# EAGLE design WeatherStation (EAGLE 7.5.0)
COMPANY: Unparallel; DRAWN: KTOWN; REV: B

## Sheet 1 of 2
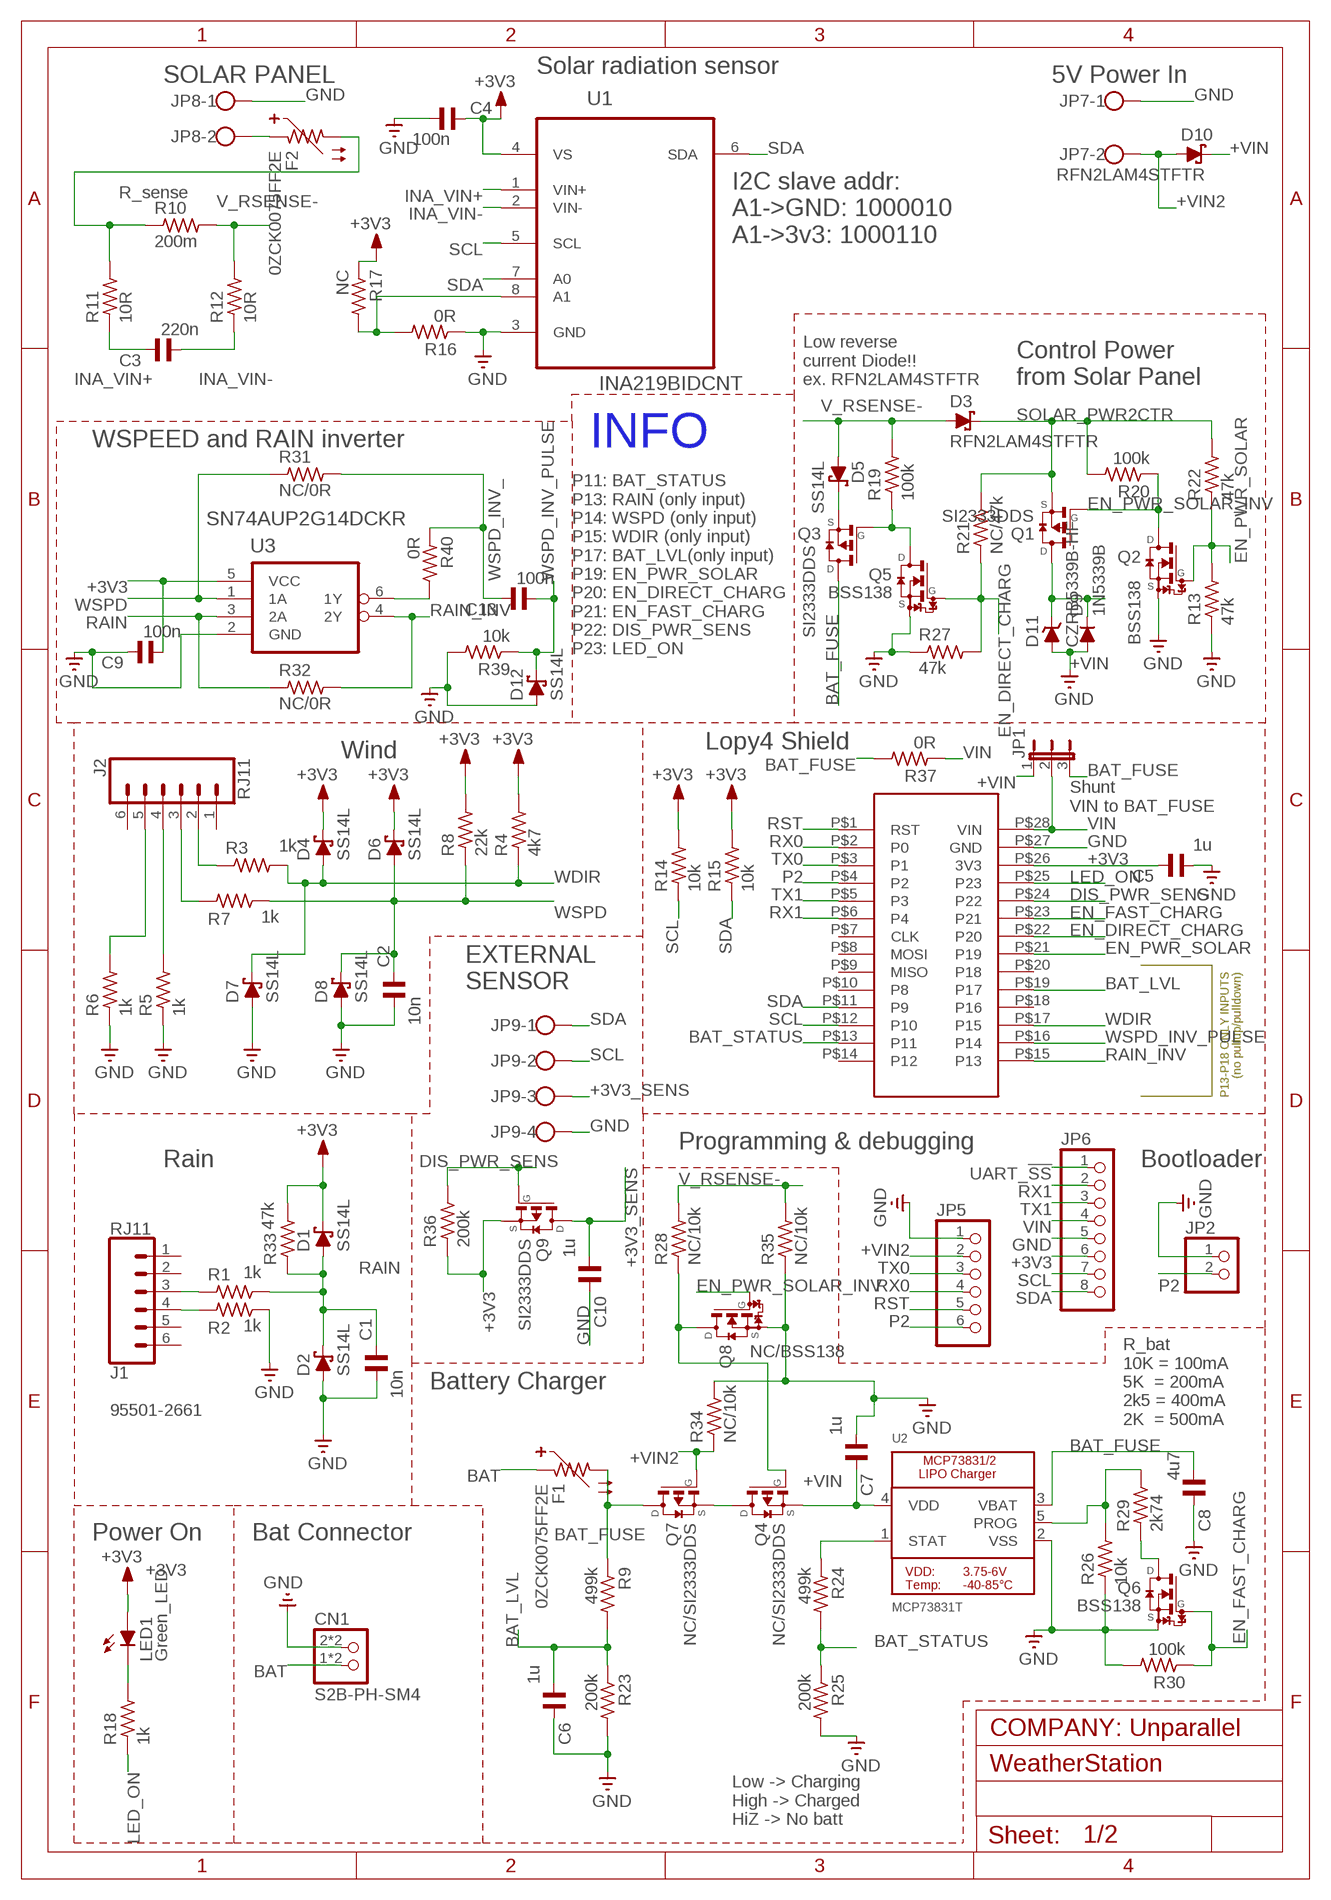
[diagram p0: schematic, sheet 1]

### Parts
C1  10n  C-EUC0603/C0805_PROTO_SLIM  [C0603/C0805_PROTO_SLIM]
C2  10n  C-EUC0603/C0805_PROTO_SLIM  [C0603/C0805_PROTO_SLIM]
C3  220n  C-EUC0603  [C0603]
C4  100n  C-EUC0603  [C0603]
C5  1u  C-EUC0603/C0805_PROTO_SLIM  [C0603/C0805_PROTO_SLIM]
C6  1u  C-EUC0603/C0805_PROTO_SLIM  [C0603/C0805_PROTO_SLIM]
C7  1u  C-EUC0603/C0805_PROTO_SLIM  [C0603/C0805_PROTO_SLIM]
C8  4u7  C-EUC0603/C0805_PROTO_SLIM  [C0603/C0805_PROTO_SLIM]
C9  100n  C-EUC0603  [C0603]
C10  1u  C-EUC0603/C0805_PROTO_SLIM  [C0603/C0805_PROTO_SLIM]
C13  100n  C-EUC0603  [C0603]
CN1  S2B-PH-SM4  JST_2PINHOR_VER  [JST-PH-2-SMT-RA_OK]
D1  SS14L  SCHOTTKY-DIODESUB_SMA_PROTO  [SUB_SMA_PROTO]
D2  SS14L  SCHOTTKY-DIODESUB_SMA_PROTO  [SUB_SMA_PROTO]
D3  RFN2LAM4STFTR  SCHOTTKY-DIODESMA_SOD-128_PROTO  [SMA_SOD-128_PROTO]
D4  SS14L  SCHOTTKY-DIODESUB_SMA_PROTO  [SUB_SMA_PROTO]
D5  SS14L  SCHOTTKY-DIODESUB_SMA_PROTO  [SUB_SMA_PROTO]
D6  SS14L  SCHOTTKY-DIODESUB_SMA_PROTO  [SUB_SMA_PROTO]
D7  SS14L  SCHOTTKY-DIODESUB_SMA_PROTO  [SUB_SMA_PROTO]
D8  SS14L  SCHOTTKY-DIODESUB_SMA_PROTO  [SUB_SMA_PROTO]
D9  1N5339B  DIODE-DO15-12  [DO15-12]
D10  RFN2LAM4STFTR  SCHOTTKY-DIODESMA_SOD-128_PROTO  [SMA_SOD-128_PROTO]
D11  CZRB5339B-HF  ZENER-DIODE-PROTO  [SMB_PROTO]
D12  SS14L  SCHOTTKY-DIODESUB_SMA_PROTO  [SUB_SMA_PROTO]
F1  0ZCK0075FF2E  PTC-0603_0805_PROTO_SLIM  [R0603/R0805_PROTO_SLIM]
F2  0ZCK0075FF2E  PTC-0603_0805_PROTO_SLIM  [R0603/R0805_PROTO_SLIM]
J1  RJ11  RJ11-6  [RJ11-6]
J2  RJ11  RJ11-6  [RJ11-6]
JP1  JP2E-0805  [R0805/2]
JP2  PINHD-1X2  [1X02]
JP5  PINHD-1X6  [1X06]
JP6  PINHD-1X8  [1X08]
JP7  W237-102  [W237-102]
JP8  W237-102  [W237-102]
JP9  W237-4  [W237-4]
LED1  Green_LED  LEDCHIP-LED0805  [CHIP-LED0805]
Q1  SI2333DDS  SI2333DDSPROTO_SLIM  [SOT23_PROTO_SLIM]
Q2  BSS138  NX7002AKPROTO_SLIM  [SOT23_PROTO_SLIM]
Q3  SI2333DDS  SI2333DDSPROTO_SLIM  [SOT23_PROTO_SLIM]
Q4  NC/SI2333DDS  SI2333DDSPROTO_SLIM  [SOT23_PROTO_SLIM]
Q5  BSS138  NX7002AKPROTO_SLIM  [SOT23_PROTO_SLIM]
Q6  BSS138  NX7002AKPROTO_SLIM  [SOT23_PROTO_SLIM]
Q7  NC/SI2333DDS  SI2333DDSPROTO_SLIM  [SOT23_PROTO_SLIM]
Q8  NC/BSS138  NX7002AKPROTO_SLIM  [SOT23_PROTO_SLIM]
Q9  SI2333DDS  SI2333DDSPROTO_SLIM  [SOT23_PROTO_SLIM]
R1  1k  R-EU_R0603  [R0603]
R2  1k  R-EU_R0603  [R0603]
R3  1k  R-EU_R0603  [R0603]
R4  4k7  R-EU_R0603  [R0603]
R5  1k  R-EU_R0603  [R0603]
R6  1k  R-EU_R0603  [R0603]
R7  1k  R-EU_R0603  [R0603]
R8  22k  R-EU_R0603  [R0603]
R9  499k  R-EU_R0603/R0805_PROTO_SLIM  [R0603/R0805_PROTO_SLIM]
R10  200m  R-EU_R0603/R0805_PROTO_SLIM  [R0603/R0805_PROTO_SLIM]
R11  10R  R-EU_R0603  [R0603]
R12  10R  R-EU_R0603  [R0603]
R13  47k  R-EU_R0603  [R0603]
R14  10k  R-EU_R0603  [R0603]
R15  10k  R-EU_R0603  [R0603]
R16  0R  R-EU_R0603  [R0603]
R17  NC  R-EU_R0603  [R0603]
R18  1k  R-EU_R0603  [R0603]
R19  100k  R-EU_R0603  [R0603]
R20  100k  R-EU_R0603  [R0603]
R21  NC/47k  R-EU_R0603  [R0603]
R22  47k  R-EU_R0603  [R0603]
R23  200k  R-EU_R0603/R0805_PROTO_SLIM  [R0603/R0805_PROTO_SLIM]
R24  499k  R-EU_R0603/R0805_PROTO_SLIM  [R0603/R0805_PROTO_SLIM]
R25  200k  R-EU_R0603/R0805_PROTO_SLIM  [R0603/R0805_PROTO_SLIM]
R26  10k  R-EU_R0603  [R0603]
R27  47k  R-EU_R0603  [R0603]
R28  NC/10k  R-EU_R0603  [R0603]
R29  2k74  R-EU_R0603/R0805_PROTO_SLIM  [R0603/R0805_PROTO_SLIM]
R30  100k  R-EU_R0603  [R0603]
R31  NC/0R  R-EU_R0603  [R0603]
R32  NC/0R  R-EU_R0603  [R0603]
R33  47k  R-EU_R0603  [R0603]
R34  NC/10k  R-EU_R0603  [R0603]
R35  NC/10k  R-EU_R0603  [R0603]
R36  200k  R-EU_R0603/R0805_PROTO_SLIM  [R0603/R0805_PROTO_SLIM]
R37  0R  R-EU_R0603  [R0603]
R39  10k  R-EU_R0603  [R0603]
R40  0R  R-EU_R0603  [R0603]
U1  INA219BIDCNT  [SOT65P280X145-8N]
U2  MCP73831T  MCP73831/2  [SOT23-5]
U3  SN74AUP2G14DCKR  SN74AUP2G14-DCKR  [SOT65P210X110-6N_EDIT]
U$2  LOPY4_SHIELD  [LOPY4_SHIELD]

### Nets
+3V3: C4.1 C5.1 C9.2 D1.C D4.C D6.C JP6.6 LED1.A Q9.2(S) R4.2 R8.2 R14.2 R15.2 R17.1 R33.2 R36.1 U1.4(VS) U3.5(VCC) U$2.P$26(3V3) ; also sheet 2
+3V3_SENS: C10.2 JP9.3 Q9.3(D)
+VIN: C7.1 D9.C D10.C D11.C JP1.1 Q1.3(D) Q4.2(S) U2.4(VDD)
+VIN2: D10.A JP5.2 JP7.2 Q7.1(G) R34.1
BAT: CN1.1 CN1.3 F1.1
BAT_FUSE: C8.2 F1.2 JP1.3 Q3.3(D) Q7.3(D) R9.1 R37.2 U2.3(VBAT)
BAT_LVL: C6.2 R9.2 R23.1 U$2.P$19(P17)
BAT_STATUS: R24.2 R25.1 U$2.P$13(P11)
DIS_PWR_SENS: Q9.1(G) R36.2 U$2.P$24(P22)
EN_DIRECT_CHARG: Q5.1(G) R21.1 R27.2 U$2.P$22(P20)
EN_FAST_CHARG: Q6.1(G) R30.1 U$2.P$23(P21)
EN_PWR_SOLAR: Q2.1(G) R13.2 R22.1 U$2.P$21(P19)
EN_PWR_SOLAR_INV: Q1.1(G) Q2.3(D) Q8.1(G) R20.1
GND: C1.2 C2.2 C4.2 C5.2 C6.1 C7.2 C8.1 C9.1 C10.1 CN1.2 CN1.4 D2.A D7.A D8.A D9.A D11.A D12.A JP2.1 JP5.1 JP6.5 JP7.1 JP8.1 JP9.4 Q2.2(S) Q5.2(S) Q6.2(S) Q8.2(S) R2.2 R5.1 R6.1 R13.1 R16.1 R23.2 R25.2 R26.1 R27.1 R30.2 R34.2 R35.1 R39.2 U1.3(GND) U2.2(VSS) U3.2(GND) U$2.P$27(GND) ; also sheet 2
INA_VIN+: C3.1 R11.1 U1.1(VIN+)
INA_VIN-: C3.2 R12.1 U1.2(VIN-)
LED_ON: R18.1 U$2.P$25(P23)
N$1: D5.C Q3.2(S)
N$2: F2.1 JP8.2
N$3: J1.4 R2.1
N$4: J1.3 R1.1
N$5: J2.2 R3.1
N$6: J2.3 R7.1
N$7: J2.4 R5.2
N$8: J2.5 R6.2
N$9: Q4.1(G) Q8.3(D) R28.1
N$10: R26.2 R29.2 U2.5(PROG)
N$11: R16.2 R17.2 U1.8(A1)
N$12: LED1.C R18.2
N$13: Q6.3(D) R29.1
N$14: R40.2 U3.6(1Y)
N$15: Q3.1(G) Q5.3(D) R19.1
N$19: R24.1 U2.1(STAT)
N$21: Q4.3(D) Q7.2(S)
P2: JP2.2 JP5.6 U$2.P$4(P2)
RAIN: C1.1 D1.A D2.C R1.2 R32.1 R33.1 U3.3(2A)
RAIN_INV: R32.2 U3.4(2Y) U$2.P$15(P13) ; also sheet 2
RST: JP5.5 U$2.P$1(RST) ; also sheet 2
RX0: JP5.4 U$2.P$2(P0)
RX1: JP6.2 U$2.P$6(P4) ; also sheet 2
SCL: JP6.7 JP9.2 R14.1 U1.5(SCL) U$2.P$12(P10) ; also sheet 2
SDA: JP6.8 JP9.1 R15.1 U1.6(SDA) U1.7(A0) U$2.P$11(P9) ; also sheet 2
SOLAR_PWR2CTR: D3.C Q1.2(S) R20.2 R21.2 R22.2
TX0: JP5.3 U$2.P$3(P1)
TX1: JP6.3 U$2.P$5(P3) ; also sheet 2
UART_!SS: JP6.1 ; also sheet 2
V_RSENSE-: D3.A D5.A R10.2 R12.2 R19.2 R28.2 R35.2
VBUS_SOLAR: F2.2 R10.1 R11.2
VIN: JP1.2 JP6.4 R37.1 U$2.P$28(VIN)
WDIR: D4.A D7.C R3.2 R4.1 U$2.P$17(P15) ; also sheet 2
WSPD: C2.1 D6.A D8.C R7.2 R8.1 R31.1 U3.1(1A)
WSPD_INV_: C13.1 R31.2 R40.1
WSPD_INV_PULSE: C13.2 D12.C R39.1 U$2.P$16(P14) ; also sheet 2
Unconnected: J1.1 J1.2 J1.5 J1.6 J2.1 J2.6 U$2.P$7(CLK) U$2.P$8(MOSI) U$2.P$9(MISO) U$2.P$10(P8) U$2.P$14(P12) U$2.P$18(P16) U$2.P$20(P18)

### Notes on the sheet
- Solar radiation sensor
- SOLAR PANEL | 5V Power In
- R_sense
- I2C slave addr:
  A1->GND: 1000010
  A1->3v3: 1000110
- Low reverse
  current Diode!!
  ex. RFN2LAM4STFTR
- Control Power
  from Solar Panel
- WSPEED and RAIN inverter | INFO
- P11: BAT_STATUS
  P13: RAIN (only input)
  P14: WSPD (only input)
  P15: WDIR (only input)
  P17: BAT_LVL(only input)
  P19: EN_PWR_SOLAR
  P20: EN_DIRECT_CHARG
  P21: EN_FAST_CHARG
  P22: DIS_PWR_SENS
  P23: LED_ON
- Lopy4 Shield
- Wind
- Shunt
  VIN to BAT_FUSE
- P13-P18 ONLY INPUTS
  (no pullup/pulldown)
- EXTERNAL
  SENSOR
- Programming & debugging
- Rain | Bootloader
- Battery Charger
- 95501-2661
- R_bat
  10K = 100mA
  5K  = 200mA
  2k5 = 400mA
  2K  = 500mA
- Power On | Bat Connector
- Low -> Charging
  High -> Charged
  HiZ -> No batt

## Sheet 2 of 2
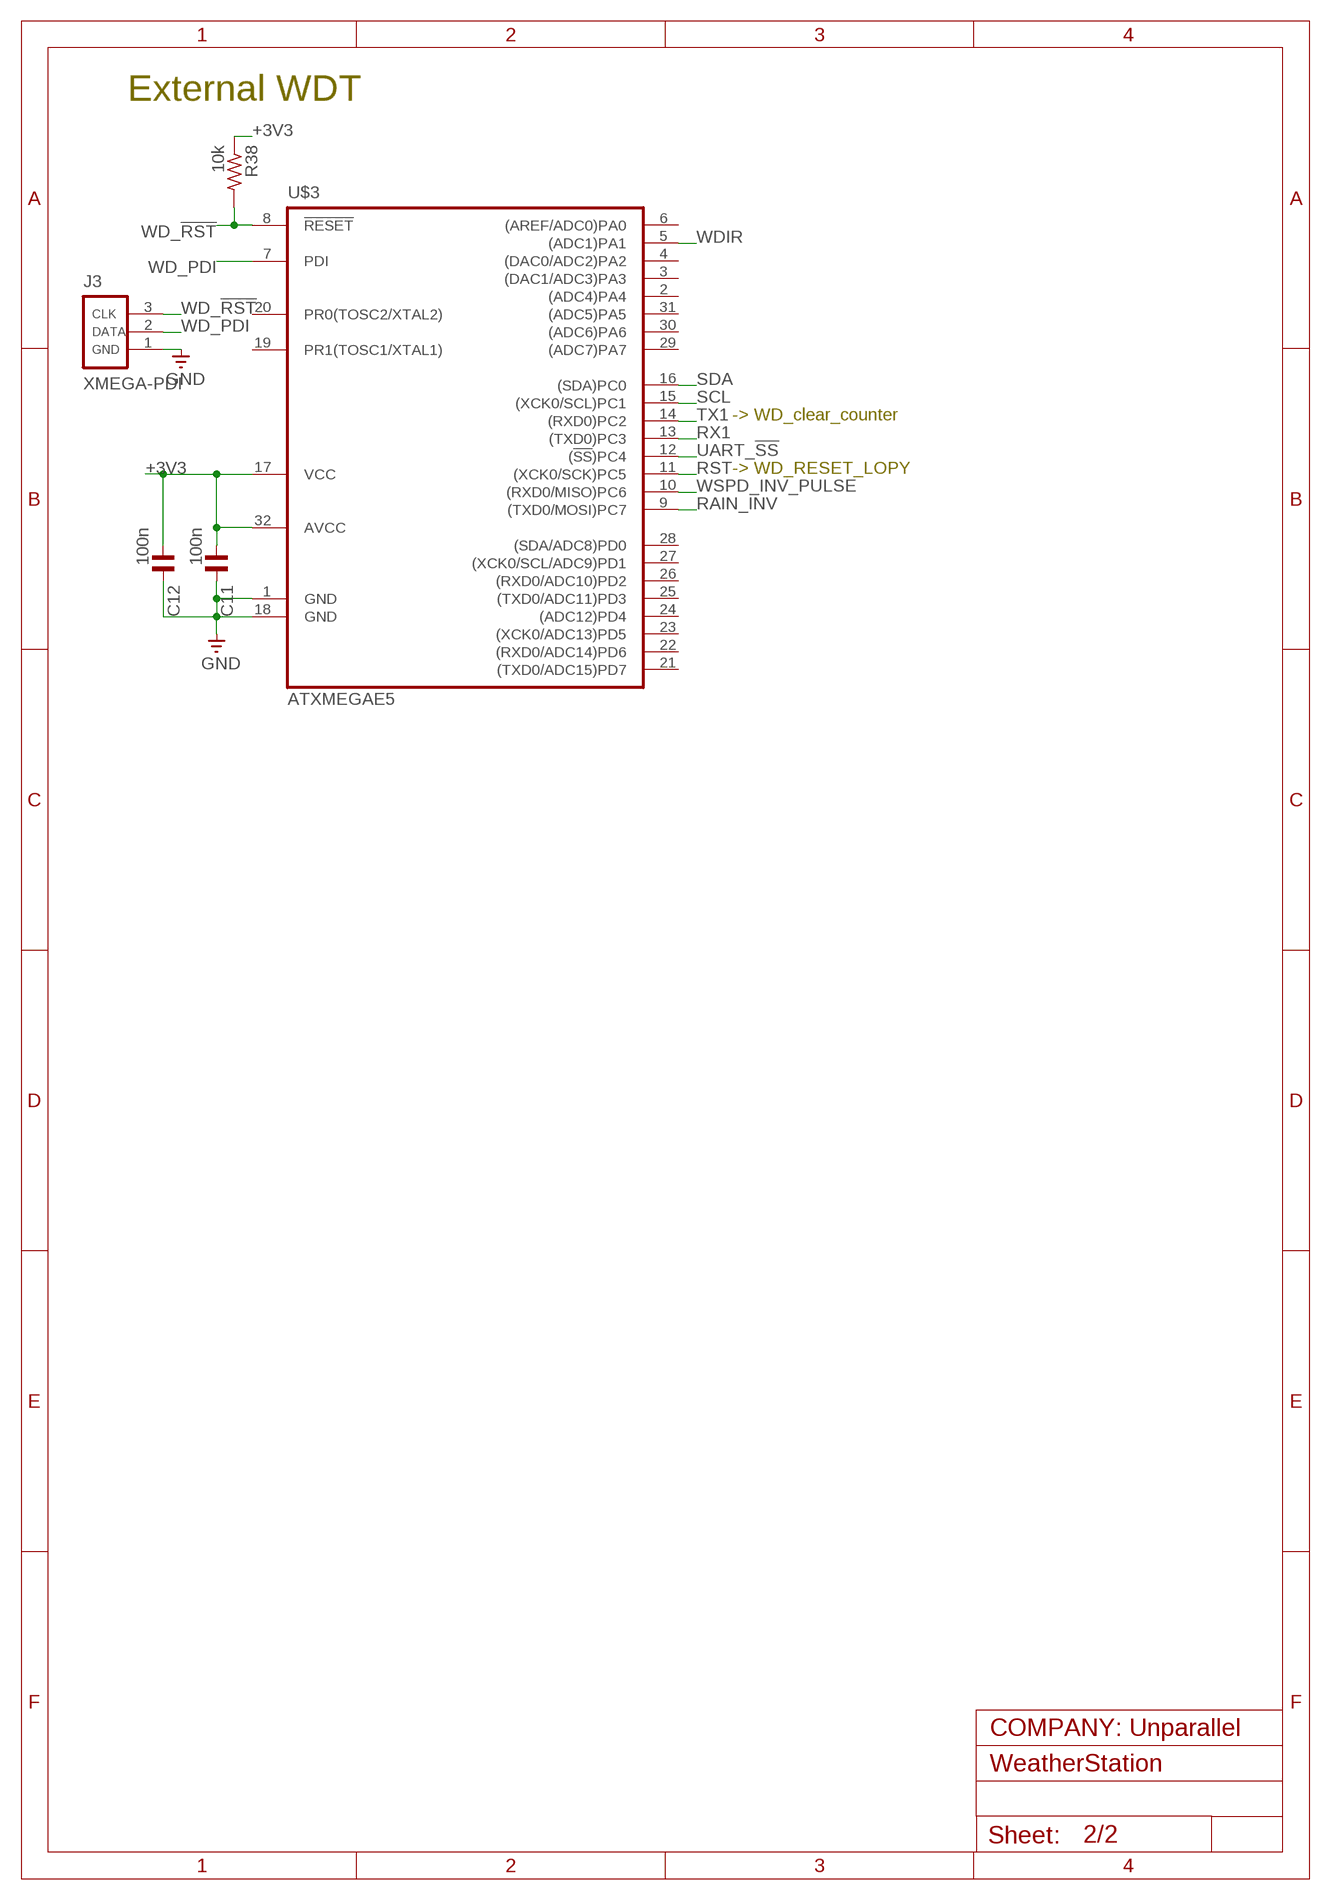
[diagram p1: schematic, sheet 2]

### Parts
C11  100n  C-EUC0603  [C0603]
C12  100n  C-EUC0603  [C0603]
J3  XMEGA-PDI  XMEGA-PDI-3_FABIO  [HDR-MA02-3P_P0.05_FABIO]
R38  10k  R-EU_R0603  [R0603]
U$3  ATXMEGAE5  ATXMEGAE5-AU_SLIM_AU  [TQFP32_PROTO_SLIM]

### Nets
+3V3: C11.2 C12.2 R38.1 U$3.17(VCC) U$3.32(AVCC) ; also sheet 1
GND: C11.1 C12.1 J3.1 U$3.1(GND) U$3.18(GND) ; also sheet 1
RAIN_INV: U$3.9((TXD0/MOSI)PC7) ; also sheet 1
RST: U$3.11((XCK0/SCK)PC5) ; also sheet 1
RX1: U$3.13((TXD0)PC3) ; also sheet 1
SCL: U$3.15((XCK0/SCL)PC1) ; also sheet 1
SDA: U$3.16((SDA)PC0) ; also sheet 1
TX1: U$3.14((RXD0)PC2) ; also sheet 1
UART_!SS: U$3.12((!SS!)PC4) ; also sheet 1
WD_!RST: J3.3 R38.2 U$3.8(!RESET!)
WD_PDI: J3.2 U$3.7(PDI)
WDIR: U$3.5((ADC1)PA1) ; also sheet 1
WSPD_INV_PULSE: U$3.10((RXD0/MISO)PC6) ; also sheet 1
Unconnected: U$3.2((ADC4)PA4) U$3.3((DAC1/ADC3)PA3) U$3.4((DAC0/ADC2)PA2) U$3.6((AREF/ADC0)PA0) U$3.19(PR1(TOSC1/XTAL1)) U$3.20(PR0(TOSC2/XTAL2)) U$3.21((TXD0/ADC15)PD7) U$3.22((RXD0/ADC14)PD6) U$3.23((XCK0/ADC13)PD5) U$3.24((ADC12)PD4) U$3.25((TXD0/ADC11)PD3) U$3.26((RXD0/ADC10)PD2) U$3.27((XCK0/SCL/ADC9)PD1) U$3.28((SDA/ADC8)PD0) U$3.29((ADC7)PA7) U$3.30((ADC6)PA6) U$3.31((ADC5)PA5)

### Notes on the sheet
- External WDT
- -> WD_clear_counter
- -> WD_RESET_LOPY

## Library data of the parts
C1-C13 = rcl_imp:C-EU: CAPACITOR, European symbol
CN1 = adafruit:JST_2PIN: JST 2-Pin Connectors of various flavors SMT-RA (S2B-PH-SM4) 4UConnector #17311 SMT (B2B-PH-SM4) THM-RA (S2B-PH) THM (B2B-PH)
D1-D8 D10 D12 = diode:SCHOTTKY-DIODE: Schottky Diode
D9 = diode:DIODE-: DIODE
D11 = diode:ZENER-DIODE: Z-Diode
F1 F2 = ptc-ntc:PTC: PTC THERMISTOR
J1 J2 = SparkFun-Connectors:RJ11-6: RJ11 Jack - 6 pin Commonly found on CAT3 devices and some Microchip programmers. Here is the connector we sell at SparkFun: RJ11 6-Pin Connector (PRT-00132) Datasheet It is used on this SparkFun product: SparkFun Weather Shield (DEV-12081) Weather Meters (SEN-08942); PROD_ID: CONN-08590; SF_ID: PRT-00132
J3 = atmel-xmega_imp:XMEGA-PDI-3_FABIO: XMEGA PDI-6 Serial Programming Header
JP1 = jumper:JP2E: JUMPER
JP2 = pinhead:PINHD-1X2: PIN HEADER
JP5 = pinhead:PINHD-1X6: PIN HEADER
JP6 = pinhead:PINHD-1X8: PIN HEADER
JP7 JP8 = con-wago-500:W237-102: WAGO SCREW CLAMP
JP9 = con-wago-500:W237-4: WAGO SCREW CLAMP
LED1 = led:LED: LED Various Types
Q1 Q3 Q4 Q7 Q9 = transistor-fet:SI2333DDS: P-Channel MOSFET
Q2 Q5 Q6 Q8 = transistor-fet:NX7002AK: N-Channel MOSFET
R1-R40 = rcl_imp:R-EU_: RESISTOR, European symbol
U1 = Texas Instruments_By_element14_Batch_1_new:INA219BIDCNT: CURRENT/POWER MONITOR with I2C? Interface; MPN: INA219BIDCNT; OC_FARNELL: 1855125; OC_NEWARK: 12T2860; PACKAGE: SOT-23-8; SUPPLIER: TEXAS INSTRUMENTS
U2 = microbuilder:MCP73831/2: MCP73831/2 LIPO Charger VDD: 3.75 - 6V Temp -40 - 85°C Programmable Charge Rate: 15-500mA NOTE: STAT is a tri-state logic output on the MCP73831 and an open-drain output on the MCP73832. SOT23-5 with 4.2V output and tri-state logic on STAT = MCP73831T-2ACI/OT
U3 = PatternAgents-TI:SN74AUP2G14: DUAL INVERTER GATE
U$2 = pycom_lib_edit:LOPY4_SHIELD
U$3 = atmel-xmega_imp:ATXMEGA*E5: Largura do barramento de dados: 8 bit/16 bit Frequência de operação máxima: 32 MHz Tamanho da memória do programa: 8 kB Tamanho RAM dos dados: 1 kB Resolução ADC: 12 bit Tensão de alimentação operacional: 1.6 V to 3.6 V

## Net classes
0 default: width 0.25 mm, drill 0.3 mm
2 VDD_3.3V: width 0.35 mm, drill 0.3 mm, clearance 0.2 mm

## Board
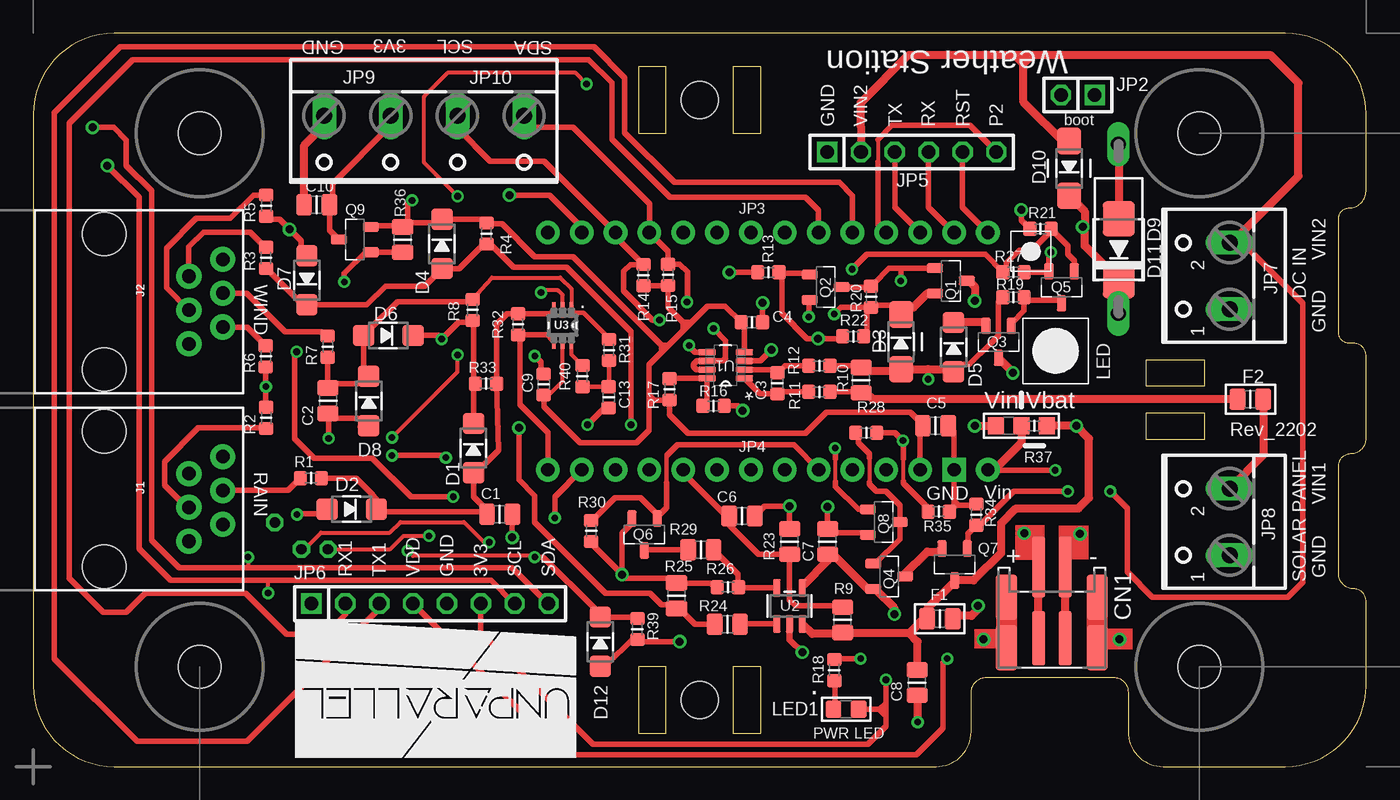
[diagram p2: board, top side]
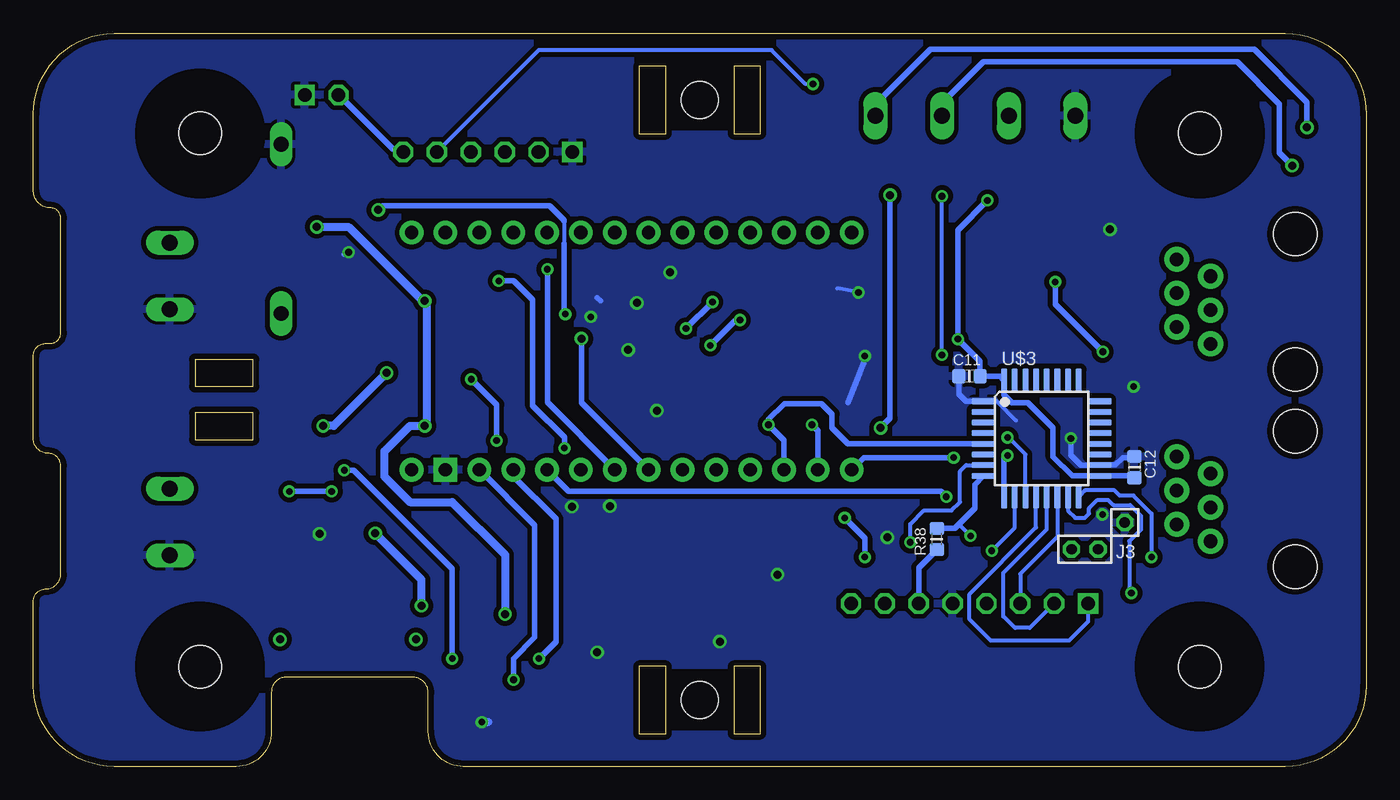
[diagram p3: board, bottom side, seen from below]

Size 100.01 x 55 mm. Coordinates in mm from the lower left corner, seen from the top.
Outline: 54 segments
Copper layers (1*16): Top 0.035mm / dielectric 1.5mm / Bottom 0.035mm
Design rules "Weather_rules": minimum track width 0.3mm, minimum drill 0.299mm, track to track 14mil, track to pad 14mil, pad to pad 14mil, via to via 12mil, smd to smd 6mil, copper to edge 18mil, drill to drill 12mil, minimum pad ring 10mil, minimum via ring 8mil, stop-mask expansion 2mil, vias tented up to drill 25mil, thermal gap 10mil
Holes 3.2 mm at 12.5,7.5 87.5,7.5 12.5,47.5 87.5,47.5
bRestrict: area 7.8,2.8 to 17.2,12.2; area 7.8,42.8 to 17.1,52.1; area 82.8,42.8 to 92.2,52.2; area 82.8,2.8 to 92.2,12.2

### Footprints (pad centres in the part's own frame; a part is rotated, then mirrored left to right if it is on the bottom)
C0603/C0805_PROTO_SLIM = smd 1.2 x 1.6: 1 -0.95,0; 2 0.95,0
C0603 = smd 1 x 1.1: 1 -0.794,0; 2 0.794,0
JST-PH-2-SMT-RA_OK = smd 1 x 4.6: 1 1,-4.565; 2 -1,-4.565 | smd 1 x 4.1: 3 1,0.765; 4 -1,0.765 | smd 1.6 x 3.4: NC1 -3.4,1.5; NC2 3.4,1.5; NC3 -3.4,-2.31; NC4 3.4,-2.31
SUB_SMA_PROTO = smd 1.6 x 1.6: A 1.85,0; C -1.85,0
SMA_SOD-128_PROTO = smd 2 x 1.8: A 2.05,0; C -2.05,0
DO15-12 = drill 1.118 long: A 6.35,0; C -6.35,0
SMB_PROTO = smd 2.6 x 2.4: A 2.322,0; C -2.322,0
R0603/R0805_PROTO_SLIM = smd 1.2 x 1.6: 1 -0.95,0; 2 0.95,0
RJ11-6 = drill 1.016 pad 1.88: 1 -3.175,8.89; 2 -1.905,6.35; 3 -0.635,8.89; 4 0.635,6.35; 5 1.905,8.89; 6 3.175,6.35 | hole 3.251: -5.08,0; 5.08,0
HDR-MA02-3P_P0.05_FABIO = drill 0.78 pad 1.27 octagon: 1 -3,-1; 2 -1,1; 3 1,1
R0805/2 = smd 1.2 x 1.3: 1 -1.905,0; 2 0,0; 3 1.905,0
1X02 = drill 1.016 square: 1 -1.27,0 | drill 1.016 octagon: 2 1.27,0
1X06 = drill 1.016 square: 1 -6.35,0 | drill 1.016 octagon: 2 -3.81,0; 3 -1.27,0; 4 1.27,0; 5 3.81,0; 6 6.35,0
1X08 = drill 1.016 square: 1 -8.89,0 | drill 1.016 octagon: 2 -6.35,0; 3 -3.81,0; 4 -1.27,0; 5 1.27,0; 6 3.81,0; 7 6.35,0; 8 8.89,0
W237-102 = drill 1.194 long: 1 -2.5,-1.27; 2 2.5,-1.27
W237-4 = drill 1.194 long: 1 -7.5,-1.27; 2 -2.5,-1.27; 3 2.5,-1.27; 4 7.5,-1.27
CHIP-LED0805 = smd 1.3 x 1.2: A 0,-0.953; C 0,0.953
SOT23_PROTO_SLIM = smd 0.7 x 1.2: 1 -0.95,-1.2; 2 0.95,-1.2; 3 0,1.2
R0603 = smd 1 x 1.1: 1 -0.794,0; 2 0.794,0
MOUNTHOLE_110MIL = hole 2.794: 0,0
SOT65P280X145-8N = smd 1.3 x 0.44: 1 -1.4,0.975; 2 -1.4,0.325; 3 -1.4,-0.325; 4 -1.4,-0.975; 5 1.4,-0.975; 6 1.4,-0.325; 7 1.4,0.325; 8 1.4,0.975
SOT23-5 = smd 0.55 x 1.3: 1 -0.95,-1.35; 2 0,-1.35; 3 0.95,-1.35; 4 0.95,1.35; 5 -0.95,1.35
SOT65P210X110-6N_EDIT = smd 1.168 x 0.356: 1 -1.168,0.66; 2 -1.168,0; 3 -1.168,-0.66; 4 1.168,-0.66; 5 1.168,0; 6 1.168,0.66
LOPY4_SHIELD = drill 1 pad 1.778: P$1 0,0; P$2 2.54,0; P$3 5.08,0; P$4 7.62,0; P$5 10.16,0; P$6 12.7,0; P$7 15.24,0; P$8 17.78,0; P$9 20.32,0; P$10 22.86,0; P$11 25.4,0; P$12 27.94,0; P$13 30.48,0; P$14 33.02,0; P$15 33.02,17.78; P$16 30.48,17.78; P$17 27.94,17.78; P$18 25.4,17.78; P$19 22.86,17.78; P$20 20.32,17.78; P$21 17.78,17.78; P$22 15.24,17.78; P$23 12.7,17.78; P$24 10.16,17.78; P$25 7.62,17.78; P$26 5.08,17.78; P$28 0,17.78 | drill 1 pad 1.778 square: P$27 2.54,17.78
TQFP32_PROTO_SLIM = smd 1.8 x 0.45: 1 -4.35,2.8; 2 -4.35,2; 3 -4.35,1.2; 4 -4.35,0.4; 5 -4.35,-0.4; 6 -4.35,-1.2; 7 -4.35,-2; 8 -4.35,-2.8; 17 4.35,-2.8; 18 4.35,-2; 19 4.35,-1.2; 20 4.35,-0.4; 21 4.35,0.4; 22 4.35,1.2; 23 4.35,2; 24 4.35,2.8 | smd 0.45 x 1.8: 9 -2.8,-4.35; 10 -2,-4.35; 11 -1.2,-4.35; 12 -0.4,-4.35; 13 0.4,-4.35; 14 1.2,-4.35; 15 2,-4.35; 16 2.8,-4.35; 25 2.8,4.35; 26 2,4.35; 27 1.2,4.35; 28 0.4,4.35; 29 -0.4,4.35; 30 -1.2,4.35; 31 -2,4.35; 32 -2.8,4.35

### Placement (x,y rotation side)
C1  35,18.93 0 top
C2  22.11,27.45 270 top
C3  55.82,28.75 90 top
C4  53.92,33.33 0 top
C5  67.7,25.57 0 top
C6  53.17,18.79 180 top
C7  59.6,16.88 90 top
C8  66.32,6.3 90 top
C9  38.3,28.66 270 top
C10  21.27,42.15 0 top
C11  29.77,29.29 0 bottom
C12  17.38,22.46 270 bottom
C13  43.18,27.7 270 top
CN1  76.42,10.4 180 top
D1  33.02,23.89 270 top
D2  23.89,19.31 180 top
D3  65.11,31.86 270 top
D4  30.66,39.21 270 top
D5  69.05,31.46 270 top
D6  26.64,32.34 180 top
D7  20.52,36.48 90 top
D8  25.17,27.42 270 top
D9  81.42,40.33 90 top
D10  77.71,44.87 90 top
D11  81.44,38.76 90 top
D12  42.55,9.37 270 top
F1  68.02,11.09 180 top
F2  91.33,27.55 180 top
J1  5.33,20.07 270 top
J2  5.33,34.88 270 top
J3  21.11,17.3 180 bottom
JP1  74.14,25.56 0 top
JP2  78.38,50.38 180 top
JP5  65.91,46.1 0 top
JP6  29.77,12.22 0 top
JP7  88.5,36.8 90 top
JP8  88.5,18.35 90 top
JP9  29.32,47.55 180 top
LED1  60.99,4.3 90 top
Q1  68.85,36.44 270 top
Q2  59.45,35.96 270 top
Q3  72.43,31.86 180 top
Q4  64.22,14.27 270 top
Q5  77.15,35.96 180 top
Q6  45.86,17.41 180 top
Q7  69.14,15.16 180 top
Q8  63.82,18.34 270 top
Q9  24.13,39.53 90 top
R1  20.83,21.64 0 top
R2  17.47,26.16 90 top
R3  17.46,38.16 270 top
R4  34,39.98 90 top
R5  17.47,42.07 90 top
R6  17.45,30.78 90 top
R7  22.09,31.5 270 top
R8  32.95,34.25 270 top
R9  60.73,11 90 top
R10  62.11,28.99 90 top
R11  58.98,28.1 0 top
R12  58.98,30.06 0 top
R13  55.16,37.08 0 top
R14  45.77,36.86 270 top
R15  47.63,36.89 270 top
R16  51.05,27.05 180 top
R17  47.75,28.3 90 top
R18  60.1,7.23 270 top
R19  73.55,35.21 180 top
R20  62.87,35.23 270 top
R21  75.57,40.34 180 top
R22  61.52,32.27 0 top
R23  56.75,16.88 90 top
R24  52.08,10.68 180 top
R25  48.27,12.82 90 top
R26  52.12,13.46 0 top
R27  73.55,37.08 180 top
R28  62.5,25.03 0 top
R29  50.09,16.27 0 top
R30  41.87,17.67 270 top
R31  43.2,31.25 270 top
R32  36.37,33.17 270 top
R33  33.97,28.73 180 top
R34  70.75,18.9 90 top
R35  67.94,19.13 180 top
R36  27.7,39.53 270 top
R37  75.11,25.56 0 top
R38  32.23,17.07 90 bottom
R39  45.32,10.32 270 top
R40  41.2,29.29 90 top
STAND2  [MOUNTHOLE_110MIL]  50,5 90 top
STAND3  [MOUNTHOLE_110MIL]  50,50 90 top
U1  51.95,30.1 180 top
U2  56.75,12.05 0 top
U3  39.71,33.09 270 top
U$1  [UNPARALLEL_LOGO_NEW_0_INVERT_BIG]  40.71,11.01 180 top
U$2  71.62,40.05 180 top
U$3  24.37,24.61 0 bottom

### Tracks (layer width: path | path; a pad name or v marks a point on that pad's centre or on a via)
+3V3  (via drill 0.5)
  Top 0.305: 38.66,28.05 C9.2 38.66,27.87 39.71,28.92 U3.5
  Top 0.406: U1.4 53.35,33.11 C4.1 51.92,34.54 50.59,34.54 48.75,32.69 | 32.67,33.2 R8.2 33.19,33.19 33.05,33.34 | 32.89,26 D1.C 33.02,26.13 33.02,28.73 | 48.75,32.69 47,30.95 | 47,30.95 46.2,30.14 46.2,27.07 | R14.2 47.29,36.07 R15.2 47.63,34.44 48.74,33.34 | 49.37,33.34 48.74,33.34 | 48.74,33.34 48.74,32.7 48.75,32.69 | 33.05,33.34 32.89,33.18 33.02,33.02 33.02,28.73 | 32.94,29.05 33.26,28.73 R33.2 33.02,28.73 | 47.31,31.43 47.15,31.59 | 47.15,31.59 47.62,31.59 | 47.15,31.59 47.15,31.11 47,30.95 | 47.15,31.59 40.48,38.26 37.62,38.26 35.16,40.72 34.26,40.72 R4.2 33.88,41.06 D4.C 30.41,40.8 28.1,40.8 | U$2.P$26 66.55,25.36 C5.1 66.82,25.57 65.8,26.59 59.53,26.59 57.94,25 49.12,25 47.75,26.38 R17.1 47.71,27.46 46.59,27.46 | 63.98,5.86 v63.98,6.51 63.98,4.76 | 63.98,4.76 63.98,3.02 62.63,1.67 41.99,1.67 33.58,10.08 JP6.6 33.58,12.2 | LED1.A 62.23,4.3 62.23,4.29 63.5,4.29 | 63.98,3.81 63.5,4.29 | 63.5,4.29 63.98,4.76 | 33.05,33.34 31.91,33.34 v30.64,32.07 30.37,32.34 D6.C | Q9.2 25.41,40.56 27.62,40.56 R36.1 27.94,40.8 28.1,40.8 | 28.1,40.8 28.1,42.15 v28.42,42.47 | C9.2 38.34,27.7 38.34,26.99 41.04,24.29 45.24,24.29 46.2,25.24 46.2,27.07 | 46.2,27.07 46.59,27.46 | 46.2,27.86 46.59,27.46
  Bottom 0.406: U$2.P$26 62.39,18.11 62.39,9.68 63.98,8.1 v63.98,6.51 63.82,6.67 | C12.2 17.54,21.67 17.46,21.67 17.84,21.81 U$3.17 22.04,21.81 23.5,23.26 23.5,25.4 25.4,27.3 26.59,27.3 27.17,27.88 U$3.32 27.5,29.29 C11.2 28.97,30.4 v30.64,32.07 30.64,40.24 v28.42,42.47 | R38.1 33.58,14.92 JP6.6
+3V3_SENS
  Top 0.406: Q9.3 22.22,40.24 C10.2 22.22,42.38 22.46,42.62 22.46,43.74 26.82,48.1 JP9.3
+VIN  (via drill 0.6)
  Top 0.5: 57.78,13.61 57.7,13.53 U2.4
  Top 0.61: Q1.3 70.17,36.43 70.22,36.43 70.64,36.01 v70.64,34.92 | v70.64,25.56 JP1.1 | v64.61,11.43 64.61,11.91 63.28,13.24 Q4.2 62.61,13.32 60,15.93 C7.1 59.6,15.43 57.78,13.61 | D9.C 81.44,34 D11.C 81.44,36.51 78.9,39.05 78.9,40.32 | D10.C 78.9,41.64 78.9,40.32 | 78.9,40.32 v78.74,40.48
  Bottom 0.61: v64.61,11.43 64.61,15.88 68.58,19.84 71.75,19.84 73.66,21.75 73.66,23.65 71.75,25.56 v70.64,25.56 70.48,25.72 70.48,34.77 v70.64,34.92 70.8,34.92 76.36,40.48 v78.74,40.48
+VIN2  (via drill 0.5)
  Top 0.406: v77.63,20.64 73.58,20.64 71.05,18.1 R34.1 70.12,17.46 70.12,16.39 Q7.1 | JP7.2 89.86,39.21 90.81,39.21 95.25,34.77 95.25,13.82 94.13,12.7 83.98,12.7 82.07,14.61 82.07,19.37 v80.8,20.64
  Top 0.61: JP5.2 62.1,47.94 62.09,49.8 65.63,53.34 73.66,53.34 | JP7.2 89.94,39.3 94.93,44.29 94.93,51.28 92.87,53.34 73.66,53.34 | D10.A 77.54,46.61 74.3,49.85 74.3,52.7 | 74.93,53.34 74.3,52.7 | 74.3,52.7 73.66,53.34
  Bottom 0.406: v77.63,20.64 v80.8,20.64
BAT  (via drill 0.6)
  Top 0.61: F1.1 68.98,11.27 68.98,11.31 70.41,11.31 70.88,11.79 v70.88,12.06 | v74.35,17.5 75.42,16.82 75.42,15.48 CN1.1 CN1.3
  Bottom 0.61: v70.88,12.06 70.88,14.03 v74.35,17.5
BAT_FUSE  (via drill 0.6)
  Top 0.305: JP1.3 R37.2
  Top 0.406: 57.76,10.64 U2.3
  Top 0.5: R9.1 61.04,10 60.99,9.95
  Top 0.61: 60.99,9.95 58.45,9.95 57.76,10.64 | C8.2 66.32,7.42 66.36,7.46 66.36,9.37 65.72,10 | 65.72,10 61.17,10 R9.1 | Q3.3 73.5,29.58 v73.5,29.53 | JP1.3 v78.26,25.56 79.22,24.61 79.22,20.16 78.42,19.37 73.74,19.37 72.63,18.26 72.63,16.03 70.56,13.96 Q7.3 69.14,13.89 67.07,11.83 F1.2 66.97,11.19 66.91,11.19 65.72,10
  Bottom 0.61: v73.5,29.53 77.47,25.56 v78.26,25.56
BAT_LVL
  Top 0.406: R9.2 60.96,11.99 60.9,12.05 57.17,12.05 56.75,12.47 R23.1 54.4,15.93 52.23,18.1 C6.2 51.97,19.05 51.75,19.05 48.77,22.04 U$2.P$19
BAT_STATUS  (via drill 0.6)
  Top 0.406: R24.2 49.63,10.68 48.74,11.57 48.26,11.59 R25.1 48.02,12.14 47.15,12.14 46.28,13.02 42.94,13.02 37.62,18.34 37.62,20.32 36.43,21.51 v36.43,25.4 | v35.72,42.86 38.73,42.86 41.15,40.45 U$2.P$13
  Bottom 0.406: v36.43,25.4 35.72,26.11 v35.72,42.86
DIS_PWR_SENS  (via drill 0.5)
  Top 0.406: 27.47,38.58 R36.2 Q9.1 24.93,38.58 23.34,36.99 v23.34,36.35 | v31.51,20.24 28.34,20.24 25.44,23.14 21.07,23.14 19.61,24.61 19.61,30.88 v19.76,31.11
  Bottom 0.406: U$2.P$24 59.83,20.64 31.91,20.64 v31.51,20.24 | v19.76,31.11 23.34,34.69 v23.34,36.35
EN_DIRECT_CHARG  (via drill 0.5)
  Top 0.406: v61.44,37.31 62.55,38.42 71.42,38.42 R27.2 73.03,37.35 73.03,37.78 73.98,38.73 74.93,38.73 76.37,40.17 R21.1 | R21.1 76.83,39.87 | Q5.1 78.1,37.94 77.63,38.42 77.63,39.08 R21.1
  Bottom 0.406: U$2.P$22 61.44,27.32 v61.44,37.31
EN_FAST_CHARG
  Top 0.35: 47.55,23.34 47.5,23.29 47.5,21.29
  Top 0.406: R30.1 42.05,18.65 42.15,18.65 43.66,20.16 45.56,20.16 46.83,18.89 46.83,18.63 Q6.1 46.91,18.79 46.99,18.89 47.5,19.4 47.5,21.29 | U$2.P$23 57.06,24.13 48.34,24.13 47.55,23.34
EN_PWR_SOLAR  (via drill 0.6)
  Top 0.406: R22.1 60.41,32.1 v58.88,32.1 58.06,32.1 56.16,33.99 56.16,37.02 R13.2 56.12,37.07 56.12,36.99 57.94,36.99 Q2.1
  Bottom 0.406: U$2.P$21 58.88,27.31 v58.88,32.1
EN_PWR_SOLAR_INV  (via drill 0.5)
  Top 0.305: 60.2,21.37 60.2,23.09
  Top 0.406: Q2.3 62.8,35.96 R20.1 63.04,36.2 63.02,36.2 64.22,37.39 65.09,37.39 | Q1.1 67.79,37.31 67.87,37.39 65.09,37.39 | Q8.1 61.91,19.29 60.2,21 60.2,21.37 | 60.2,23.09 60.2,23.86 v60.17,23.89 | v65.09,36.43 65.09,37.39
  Bottom 0.406: v60.17,23.89 60.17,24.69 62.55,27.07 62.55,35 63.98,36.43 v65.09,36.43
GND  (via drill 0.5, 0.6)
  Top 0.305: U3.2 39.71,35.38 39.37,35.72 38.26,35.72 v38.1,35.56
  Top 0.406: U1.3 54.55,30.43 v55.38,31.25 | v59.6,19.49 C7.2 59.96,17.82 60.25,17.54 62.86,17.54 Q8.2 | C4.2 v54.73,34.77 | R13.1 v52.22,37.08 | C1.2 v35.93,17.19 | D2.A 21.67,18.97 19.85,18.97 v19.79,18.91 | R6.1 v17.45,28.51 17.45,27.09 R2.2 | R16.1 52.88,27.05 v53.23,26.7 | v44.17,14.4 44.44,14.13 47.86,14.13 R25.2 50.84,13.77 51.28,13.34 R26.1 | R23.2 v56.75,19.54 54.87,19.54 C6.1 | Q2.2 58.18,35.17 v58.18,33.74 v58.18,33.73 58.26,33.97 | Q6.2 44.91,18.24 44.17,17.5 v44.17,14.4 | R30.2 41.91,16.75 41.91,16.68 44.17,14.41 v44.17,14.4 | C9.1 38.57,29.3 38.1,29.77 38.1,30.32 v37.62,30.8 | C5.2 69.08,25.14 U$2.P$27 69.08,19.95 | R27.1 76.13,37.08 Q5.2 76.2,38.42 v76.36,38.58 | R34.2 70.67,19.61 69.43,19.61 69.08,19.95 | R35.1 69.22,19.61 | 69.22,19.61 69.85,19.61 | 69.08,19.48 69.08,19.61 | 69.08,19.61 69.08,19.95 | 69.22,19.61 69.08,19.61 | R5.1 17.75,41.04 18.47,41.04 v19.22,40.29 20.08,39.43 20.08,38.81 20.52,38.37 D7.A | D8.A 24.54,25.49 | 25.15,25.55 D8.A | D8.A 25.15,25.57 24.61,26.11 22.49,26.11 C2.2 22.11,26.39 22.16,26.34 v22.16,24.62 | D12.A 42.81,7.78 43.1,7.7 44.93,9.53 45.24,9.53 R39.2 45.33,9.37 v48.5,9.37
  Top 0.5: U2.2 56.75,9.53 v57.7,8.58
  Top 0.61: v78.54,17.45 78.05,17.25 77.42,16.62 CN1.2 CN1.4 | C8.1 66.32,5.12 66.36,5.08 v66.36,3.33 | D9.A 81.44,46.67 D11.A | C10.1 20.32,46.6 21.82,48.1 JP9.4
  Bottom 0.305: v38.1,35.56 39.69,35.88 | U$3.1 27.72,27.41 26.27,25.96 | 17.62,23.18 17.54,23.26 C12.1
  Bottom 0.406: 57.71,35.16 57.47,34.92 | v37.62,30.8 37.7,30.32 38.89,27.3 | v76.36,38.58 76.52,38.58 76.68,38.42 | v22.16,24.62 22.16,23.35 21.42,22.61 U$3.18 20,22.62 18.81,22.62 18.26,23.18 17.62,23.18 | C11.1 30.56,27.94 30.03,27.41 U$3.1 | v48.5,9.37 48.58,9.45 48.66,9.45
  Bottom 0.61: v66.36,3.33 65.88,3.33
  pour Bottom: 6.08,0 93.93,0 arc90 100,6.08 100,48.94 arc90 93.93,55 6.08,55 arc90 0,48.92 0,6.08 arc90
INA_VIN+
  Top 0.406: U1.1 54.52,27.96 C3.1 56.08,27.86 56.2,28.02 56.27,28.1 R11.1
INA_VIN-
  Top 0.406: R12.1 56.42,30.06 56.2,29.84 56.1,29.82 C3.2 55.66,29.77 U1.2
LED_ON  (via drill 0.5)
  Top 0.406: R18.1 60.25,8.1 61.6,8.1 v62.07,8.1
  Bottom 0.406: v62.07,8.1 60.8,9.37 60.8,18.57 64,21.78 U$2.P$25
N$1
  Top 0.61: Q3.2 71.22,33.31 D5.C
N$2
  Top 0.61: JP8.2 92.34,23.42 92.34,27.52 92.31,27.54 F2.1
N$3
  Top 0.406: R2.1 17.44,25.4 12.38,25.4 9.84,22.86 9.84,21.11 11.52,19.44 J1.4
N$4
  Top 0.406: J1.3 19.11,20.71 R1.1
N$5
  Top 0.406: R3.1 17.22,39.13 16.29,40.07 12.77,40.07 11.68,38.98 J2.2
N$6
  Top 0.406: J2.3 16.01,35.51 18.89,32.62 21.59,32.62 21.93,32.29 R7.1
N$7
  Top 0.406: J2.4 10,35.91 10,38.89 12.22,41.12 14.76,41.12 16.52,42.87 R5.2
N$8
  Top 0.406: J2.5 16.05,32.97 R6.2
N$9
  Top 0.305: 62.74,23.18 62.74,21.34
  Top 0.406: R28.1 61.91,24.66 61.91,24.29 62.74,23.46 62.74,23.18 | 62.74,21.34 62.74,21.16 63.26,20.64 63.98,20.64 65.01,19.61 65.01,18.74 Q8.3 65.25,18.34 65.09,18.18 65.01,18.18 65.01,17.07 63.16,15.22 Q4.1
N$10
  Top 0.406: U2.5 53.1,13.4 53.1,13.41 R26.2 52.86,13.49 52.86,14.44 R29.2
N$11
  Top 0.406: R17.2 47.78,29.12 U1.8 50.55,27.34 R16.2
N$12
  Top 0.406: LED1.C 60.17,4.43 60.17,4.6 60.17,6.5 R18.2
N$13
  Top 0.406: R29.1 45.92,16.27 Q6.3
N$14
  Top 0.305: R40.2 40.37,30.91 U3.6
N$15
  Top 0.406: Q5.3 76.92,34.99 74.56,34.99 R19.1 74.34,34.18 73.5,33.34 73.5,33.18 Q3.1
N$16  (via drill 0.6)
  other vias: 71.3,9.54
N$17  (via drill 0.6)
  other vias: 81.5,9.54
N$19
  Top 0.406: U2.1 53.39,10.7 R24.1
N$21
  Top 0.61: Q4.3 65.42,14.47 67.07,16.12 67.95,16.12 Q7.2
P2
  Top 0.305: 63.37,47.03 63.37,45.36
  Top 0.406: JP5.6 70.26,48.1 64.44,48.1 63.37,47.03 | 63.37,45.36 63.37,40.68 U$2.P$4
  Bottom 0.406: JP5.6 72.59,46.1 72.79,46.3 73.03,46.3 JP2.2
RAIN
  Top 0.35: 38.97,34.13 38.92,34.12 U3.3
  Top 0.406: 38.97,34.13 38.81,33.97 R32.1 36.22,33.97 35.56,33.97 34.77,33.18 34.77,28.97 34.92,28.81 R33.1 34.92,23.73 33.58,22.38 33.13,22.38 D1.A 33.02,20.24 34.05,19.21 34.05,19.13 34.05,18.81 C1.1 33.85,19.13 26.04,19.13 D2.C 25.74,20.09 25.45,20.38 25.45,20.4 24.21,21.64 R1.2
RAIN_INV  (via drill 0.5)
  Top 0.35: 38.9,32.08 U3.4
  Top 0.406: 38.9,32.08 38.97,31.99 38.58,32.38 R32.2 36.45,32.15 36.67,32.07 36.51,32.07 36.51,27.14 38.6,25.05 U$2.P$15 | v30.96,23.18 30.8,23.34 v26.91,23.34
  Bottom 0.406: U$2.P$15 37.7,23.18 v30.96,23.18 | U$3.9 27.17,23.08 v26.91,23.34
RST  (via drill 0.5)
  Top 0.305: v26.91,24.69 31.83,29.61 v31.83,30.88 | v31.83,42.78 29.33,45.28 29.33,50.26 31.14,52.07 40.64,52.07 v41.51,51.2
  Top 0.406: 71.64,40.06 U$2.P$1 69.72,41.95 JP5.5
  Bottom 0.305: U$3.11 25.57,23.43 26.83,24.69 v26.91,24.69 | v31.83,30.88 v31.83,42.78 | v41.51,51.2 42.07,51.2 44.61,53.74 62.09,53.74 JP5.5
RX0
  Top 0.406: 69.09,40.06 U$2.P$2 67.18,41.95 JP5.4
RX1
  Top 0.406: U$2.P$6 58.92,41.72 57.94,42.7 47.78,42.7 43.42,47.07 43.42,51.28 41.67,53.02 7.46,53.02 2.7,48.26 2.7,14.13 5.24,11.59 6.99,11.59 8.41,13.02 15.93,13.02 19.02,9.92 21.91,9.92 23.42,11.43 JP6.2
  Bottom 0.305: JP6.2 25.24,10.4 26.35,10.4 27.23,11.27 27.23,14.53 23.97,17.78 U$3.13
SCL  (via drill 0.5, 0.6)
  Top 0.305: v17.62,13.02 17.62,13.97
  Top 0.406: U1.5 49.65,31.07 49.21,31.52 v49.21,31.59 | v46.99,33.5 46.48,33.5 44.27,35.7 44.27,37.14 44.79,37.66 R14.1 43.69,39.74 U$2.P$12 38.33,45.4 34.29,45.4 31.82,47.87 JP9.2 | v5.56,45.09 7.94,42.7 7.94,16.35 10.32,13.97 17.62,13.97 34.34,13.97 36.09,12.22 JP6.7
  Bottom 0.305: U$3.15 22.37,19.19 21.83,18.65 21.11,18.65 20.8,18.97 20.8,19.37 20.16,20 19.37,20 18.97,19.61 17.7,19.61 16.91,18.81 16.91,17.78 17.78,16.91 17.78,13.26 v17.62,13.02
  Bottom 0.406: v49.21,31.59 47.31,33.5 v46.99,33.5 | v5.56,45.09 6.51,46.04 6.51,49.69 9.68,52.86 28.73,52.86 31.82,49.77 JP9.2
SDA  (via drill 0.5, 0.6)
  Top 0.305: v16.11,15.72 16.11,14.92
  Top 0.406: U1.7 49.76,29.77 49.53,30 49.53,30.16 49.79,30.43 U1.6 51.75,30.43 51.95,30.62 51.95,31.95 v51.04,32.86 | v49.05,34.85 49.08,34.95 49.08,37.1 48.5,37.68 R15.1 47.63,38.64 U$2.P$11 46.23,42.2 40.48,47.94 37.62,47.94 36.83,48.74 JP9.1 | v4.45,47.94 6.03,47.94 6.99,46.99 6.99,45.09 8.89,43.18 8.89,16.99 10.95,14.92 16.11,14.92 35.93,14.92 38.63,12.22 JP6.8
  Bottom 0.305: v16.11,15.72 16.11,18.97 17.46,20.32 18.49,20.32 18.89,20.72 21.11,20.72 U$3.16
  Bottom 0.406: v49.05,34.85 v51.04,32.86 | JP9.1 36.67,48.97 36.67,49.85 32.7,53.82 8.41,53.82 4.45,49.85 v4.45,47.94
SOLAR_PWR2CTR  (via drill 0.5, 0.6)
  Top 0.406: R20.2 62.85,34.44 62.55,34.45 62.55,32.5 R22.2 | R20.2 63.01,34.61 64.73,34.61 D3.C | R21.2 74.14,40.98 v74.14,41.75 | v60.1,33.94 60.59,34.44 R20.2
  Top 0.61: D3.C 65.58,34.22 66.04,34.45 67.08,35.49 Q1.2
  Bottom 0.305: 60.19,40.9 60.19,39.21
  Bottom 0.406: v74.14,41.75 73.82,42.07 61.28,42.07 60.19,40.98 60.19,40.9 | 60.19,39.21 60.19,34.03 v60.1,33.94
TX0
  Top 0.406: U$2.P$3 64.64,41.97 JP5.3
TX1
  Top 0.406: U$2.P$5 61.47,42.83 60.48,43.81 48.1,43.81 44.37,47.55 44.37,51.67 42.07,53.98 6.51,53.98 1.59,49.05 1.59,8.1 7.78,1.91 16.03,1.91 25.96,11.83 JP6.3
  Bottom 0.305: U$3.14 23.17,17.23 25.96,14.45 JP6.3
UART_!SS
  Bottom 0.305: JP6.1 20.88,10.87 22.3,9.45 28.18,9.45 29.77,11.03 29.77,12.94 24.77,17.94 U$3.12
V_RSENSE-  (via drill 0.5)
  Top 0.305: 65.28,21.41 65.28,23.08
  Top 0.406: 61.91,30 61.98,29.94 R10.2 61.99,30.06 R12.2 | R19.2 72.43,34.88 72.43,32.33 71.86,31.76 71.85,31.76 70.26,30.16 69.69,30.16 69.14,29.61 D5.A | v67.15,29.05 67.15,29.81 | R28.2 64.67,25.03 v65.25,24.45 65.28,24.42 65.28,23.08 | R35.2 67.15,19.37 65.28,21.24 65.28,21.41
  Top 0.61: R10.2 62.55,29.92 62.77,29.7 65.31,29.7 D3.A 67.15,29.81 68.85,29.81 D5.A
  Bottom 0.406: v65.25,24.45 65.25,27.15 v67.15,29.05
VBUS_SOLAR
  Top 0.406: R11.2 61.91,28.1 61.91,28.02 62.01,27.94 R10.1
  Top 0.61: 62.42,27.95 R10.1 62.19,28.04 62.39,28.02 62.52,28.02 62.99,27.55 F2.2
VIN  (via drill 0.5)
  Top 0.305: R37.1 JP1.2
  Top 0.406: v68.58,8.1 68.26,7.78 68.26,2.86 66.28,0.87 39.82,0.87 28.5,12.2 JP6.4 | U$2.P$28 71.62,22.36 72.39,22.23 v76.68,22.23
  Top 0.61: JP1.2 74.14,24.29 72.12,22.27 U$2.P$28
  Bottom 0.406: v68.58,8.1 68.58,14.84 75.96,22.23 v76.68,22.23
WD_!RST  (via drill 0.5)
  Top 0.305: J3.3 26.78,16.3 27.78,17.3 v29.69,17.3
  Bottom 0.305: 30.88,17.86 30.64,18.1 30.48,18.1 v29.69,17.3
  Bottom 0.406: R38.2 30.88,17.86 29.37,19.37 29.37,21.16 U$3.8
WD_PDI  (via drill 0.5)
  Top 0.305: J3.2 20.35,16.3 21.59,17.54 26.75,17.54 27.54,18.34 32.31,18.34 33.81,16.83 v34.21,16.83
  Bottom 0.305: v34.21,16.83 34.21,18.18 33.18,19.21 31.11,19.21 30.48,19.84 30.48,22.15 30.02,22.61 U$3.7
WDIR  (via drill 0.5)
  Top 0.406: R4.1 33.81,39.21 | 33.81,39.21 34.29,39.21 36.04,37.47 40.01,37.47 44.85,32.62 v44.85,25.64 | 33.81,39.21 31.96,37.36 D4.A 29.34,36.04 26.43,36.04 25.02,34.63 D7.C 20.23,34.92 19.92,34.92 17.48,37.37 R3.2
  Bottom 0.406: U$3.5 38.89,24.21 40.08,25.4 40.08,26.43 40.88,27.23 43.66,27.23 44.85,26.04 v44.85,25.64 43.69,24.48 U$2.P$17
WSPD
  Top 0.305: R8.1 34.42,36.67 39.53,36.67 40.37,35.83 U3.1
  Top 0.35: U3.1 40.37,34.08 40.4,34.05 41.27,34.05 43.2,32.13 R31.1
  Top 0.406: D6.A 24.28,32.7 24.45,32.7 | R8.1 32.34,34.88 27.34,34.88 25.32,32.86 25.31,32.86 D6.A | D6.A 24.79,29.58 | 24.79,29.58 D8.C | 24.79,29.58 24.71,29.65 24.69,29.62 24.69,28.81 24.61,28.73 22.44,28.73 C2.1 22.09,28.42 R7.2
WSPD_INV_
  Top 0.35: R40.1 | R40.1 C13.1 43.2,28.5 R31.2
WSPD_INV_PULSE  (via drill 0.5)
  Top 0.305: v37.62,15.72 37.54,15.8 28.5,15.8 v28.1,16.19
  Top 0.406: v41.59,25.64 42.7,26.75 C13.2 | U$2.P$16 39.13,20.26 v39.13,18.65 | v37.62,15.72 38.26,15.72 42.15,11.83 42.15,11.61 D12.C 42.6,11.27 42.67,11.19 45.16,11.19 R39.1
  Bottom 0.305: v28.1,16.19 26.37,17.92 U$3.10
  Bottom 0.406: U$2.P$16 41.15,25.19 v41.59,25.64 | v39.13,18.65 37.62,17.14 v37.62,15.72
(copper drawn outside any net)
  shapes: Top area x6

### Text on the board
tPlace: GND | 3V3 | SCL | SDA | Weather Station | boot | GND | VIN2 | TX | RX | RST | P2 | VIN2 | DC IN | WIND | GND | LED | Vin | Vbat | Rev_2202 | SOLAR PANEL | RAIN | VIN1 | GND | Vin | GND | RX1 | TX1 | VDD | GND | 3V3 | SCL | SDA | . | PWR LED
tNames: JP10 | JP3 | JP4